# Altium schematic sheet ESP32_S3.SchDoc: =title
size A3; PageSetup: Record=PageOptions|CenterHorizontal=True|CenterVertical=True|PrintScale=1.00|XCorrection=1.00|YCorrection=1.00|PrintKind=0|BorderSize=5000000|LeftOffset=0|BottomOffset=0|Orientation=2|PaperLength=1000|PaperWidth=1000|Scale=100|PaperSource=15|PrintQuality=600|MediaType=1|DitherType=10|PaperKind=Letter|PrintScaleMode=1; DocumentNumber: 4; SheetNumber: 4; SheetTotal: 9
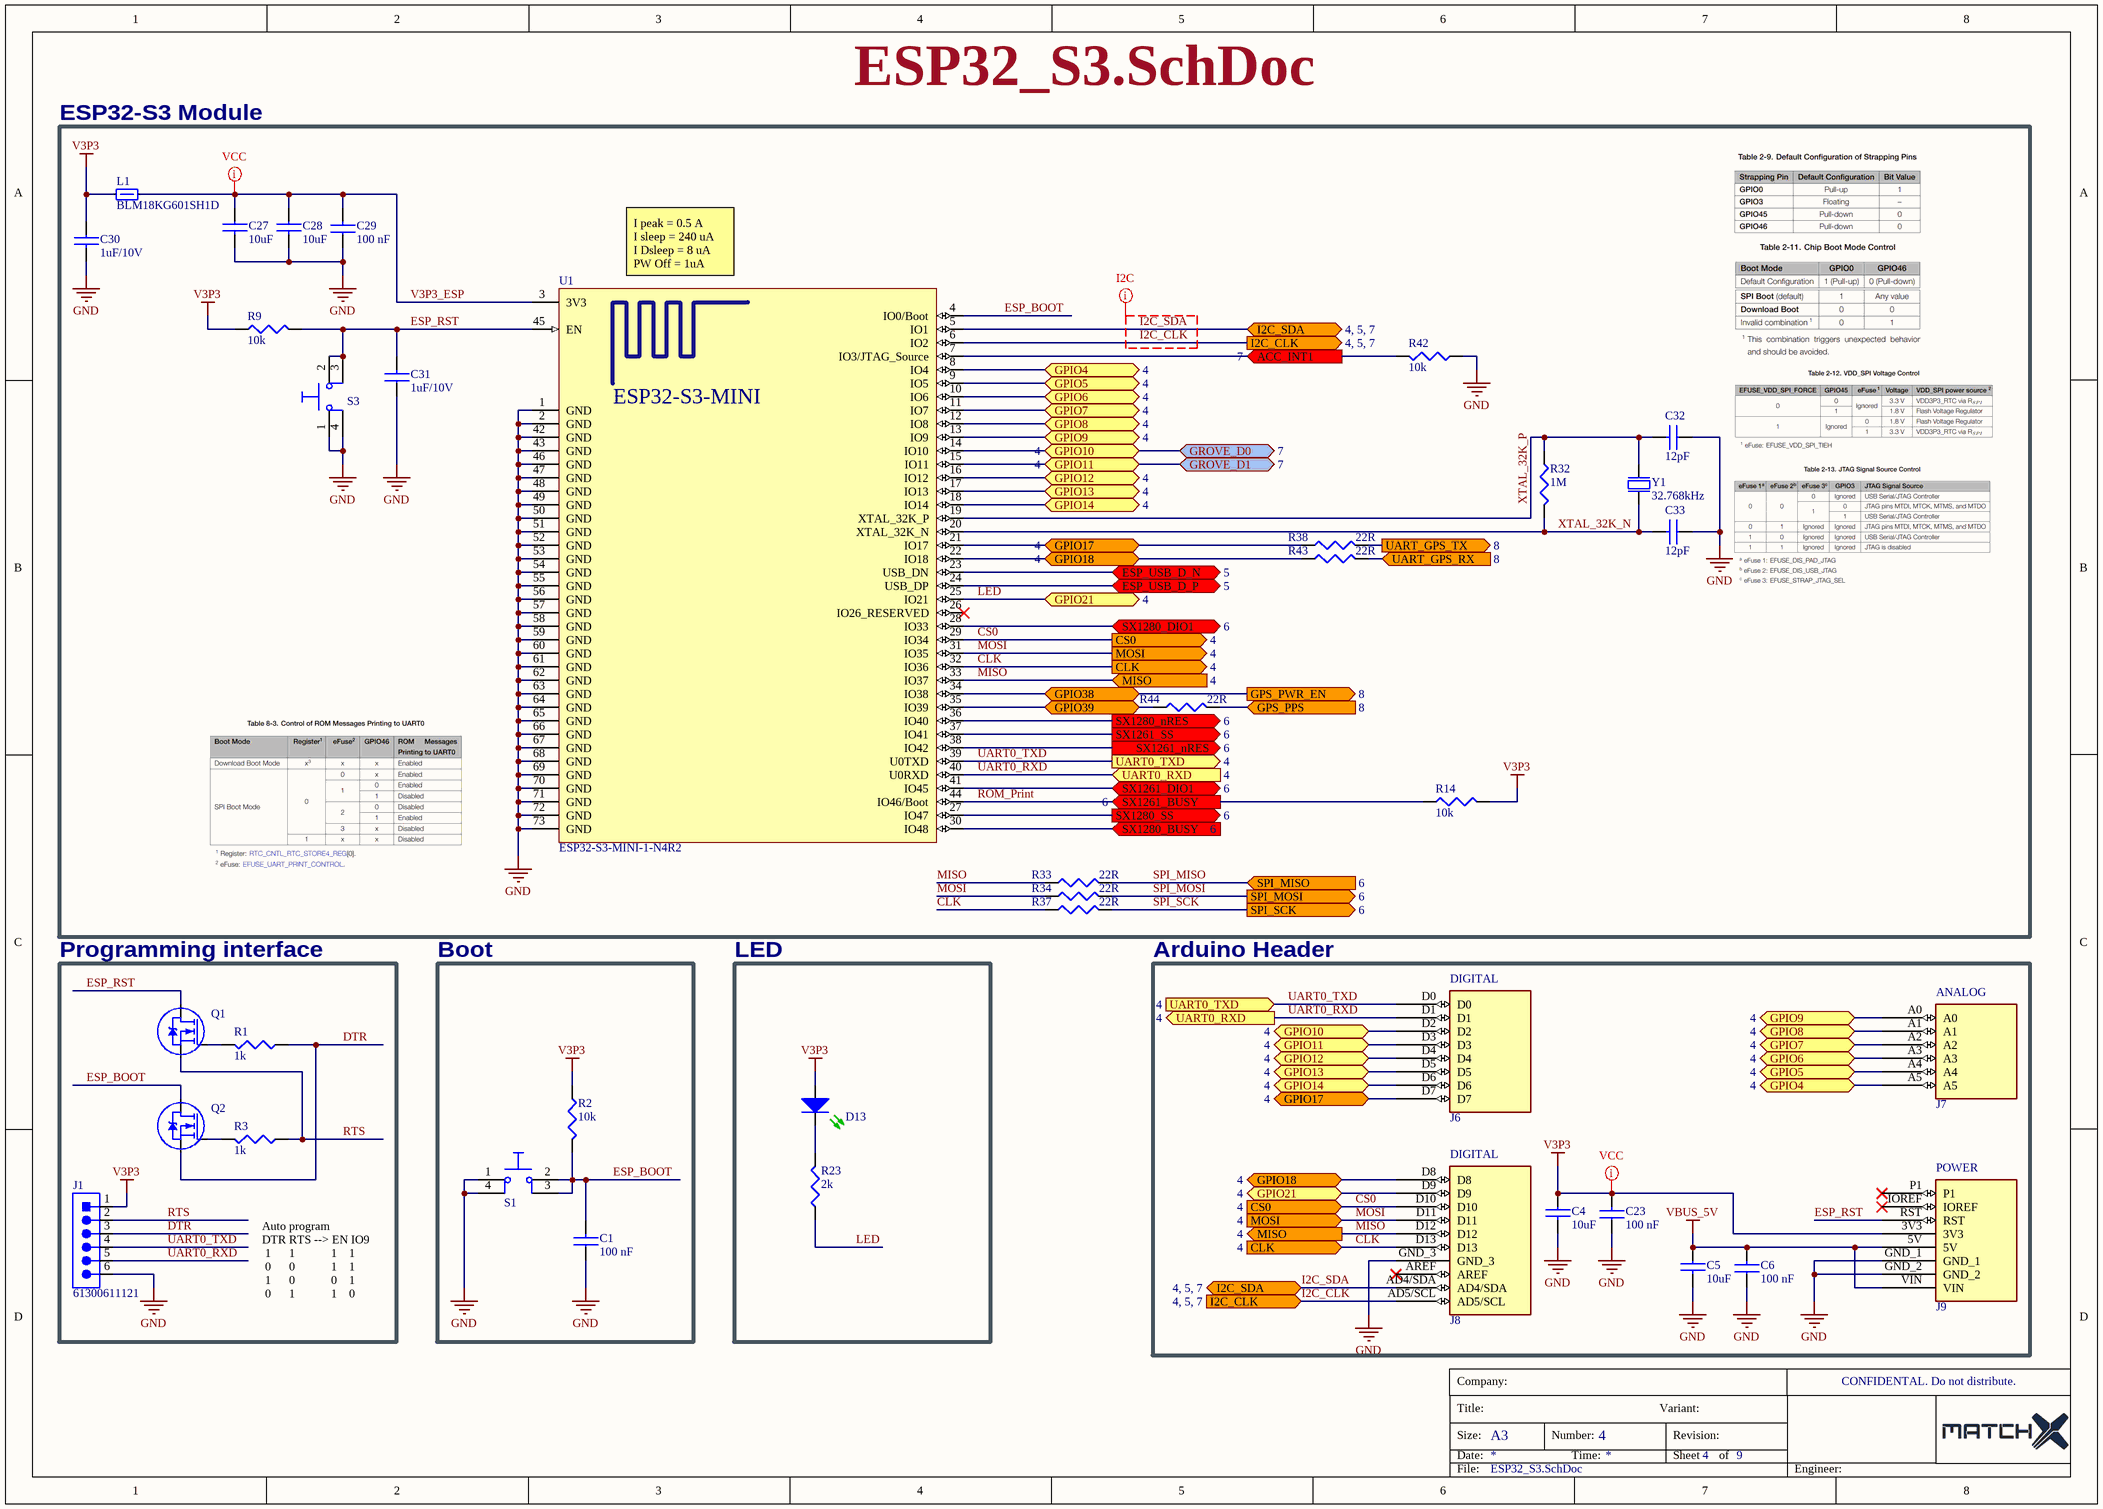
[diagram p0: ESP32_S3.SchDoc]

## Parts
C1  100 nF  [C0402]
C4  10uF  [C0805]
C5  10uF  [C0805]
C6  100 nF  [C0402]
C23  100 nF  [C0402]
C27  10uF  [C0805]
C28  10uF  [C0805]
C29  100 nF  [C0402]
C30  1uF/10V  [C0402]
C31  1uF/10V  [C0402]
C32  12pF  [C0402]
C33  12pF  [C0402]
D13  LTST-S270KGKT  [LED0603_RA]  (value not drawn)
J1  61300611121  [WURTH_61300611121]
J6  Arduino_Conn  [Arduino-C]  (value not drawn)
J7  Arduino_Conn  [Arduino-B]  (value not drawn)
J8  Arduino_Conn  [Arduino-D]  (value not drawn)
J9  Arduino_Conn  [Arduino-A]  (value not drawn)
L1  BLM18KG601SH1D  [L0603]
Q1  DMN3023L-7  [SOT-23]  (value not drawn)
Q2  DMN3023L-7  [SOT-23]  (value not drawn)
R1  1k  [R0603]
R2  10k  [R0402]
R3  1k  [R0603]
R9  10k  [R0402]
R14  10k  [R0402]
R23  2k  [R0603]
R32  1M  [R0402]
R33  22R  [R0402]
R34  22R  [R0402]
R37  22R  [R0402]
R38  22R  [R0402]
R42  10k  [R0402]
R43  22R  [R0402]
R44  22R  [R0402]
S1  TS-1108A  [TS-1108A]  (value not drawn)
S3  TS-1108A  [TS-1108A]  (value not drawn)
U1  ESP32-S3-MINI-1-N4R2  [ESP32-S3-MINI-1-N4R2]
Y1  32.768kHz  [XTAL_3215]

## Blocks framed on the sheet
ESP32-S3 Module: C27-C33 L1 R9 R14 R32-R34 R37 R38 R42-R44 S3 U1 Y1
Programming interface: J1 Q1 Q2 R1 R3
Boot: C1 R2 S1
LED: D13 R23
Arduino Header: C4-C6 C23 J6-J9

## Ports
ACC_INT1 (in, see 7), CLK (in, see 4), CLK (out, see 4), CS0 (in, see 4), CS0 (out, see 4), ESP_USB_D_N (bidir, see 5), ESP_USB_D_P (bidir, see 5), GPIO4 (bidir, see 4), GPIO5 (bidir, see 4), GPIO6 (bidir, see 4), GPIO7 (bidir, see 4), GPIO8 (bidir, see 4), GPIO9 (bidir, see 4), GPIO10 (bidir, see 4), GPIO11 (bidir, see 4), GPIO12 (bidir, see 4), GPIO13 (bidir, see 4), GPIO14 (bidir, see 4), GPIO17 (bidir, see 4), GPIO18 (bidir, see 4), GPIO21 (bidir, see 4), GPIO38 (bidir), GPIO39 (bidir), GPS_PPS (in, see 8), GPS_PWR_EN (out, see 8), GROVE_D0 (bidir, see 7), GROVE_D1 (bidir, see 7), I2C_CLK (in, see 4, 5, 7), I2C_CLK (out, see 4, 5, 7), I2C_SDA (bidir, see 4, 5, 7), MISO (in, see 4), MISO (out, see 4), MOSI (in, see 4), MOSI (out, see 4), SPI_MISO (in, see 6), SPI_MOSI (out, see 6), SPI_SCK (out, see 6), SX1261_BUSY (in, see 6), SX1261_DIO1 (bidir, see 6), SX1261_nRES (out, see 6), SX1261_SS (out, see 6), SX1280_BUSY (in, see 6), SX1280_DIO1 (bidir, see 6), SX1280_nRES (out, see 6), SX1280_SS (out, see 6), UART0_RXD (in, see 4), UART0_RXD (out, see 4), UART0_TXD (in, see 4), UART0_TXD (out, see 4), UART_GPS_RX (in, see 8), UART_GPS_TX (out, see 8)

## Nets
GND: C1.1 C4.2 C5.2 C6.1 C23.1 C27.2 C28.2 C29.1 C30.2 C31.1 C32.1 C33.1 J1.6 J8.GND_3 J9.GND_1 J9.GND_2 R42.1 S1.1 S1.4 S3.1 S3.4 U1.1(GND) U1.2(GND) U1.42(GND) U1.43(GND) U1.46(GND) U1.47(GND) U1.48(GND) U1.49(GND) U1.50(GND) U1.51(GND) U1.52(GND) U1.53(GND) U1.54(GND) U1.55(GND) U1.56(GND) U1.57(GND) U1.58(GND) U1.59(GND) U1.60(GND) U1.61(GND) U1.62(GND) U1.63(GND) U1.64(GND) U1.65(GND) U1.66(GND) U1.67(GND) U1.68(GND) U1.69(GND) U1.70(GND) U1.71(GND) U1.72(GND) U1.73(GND)
V3P3: C4.1 C23.2 C30.1 D13.A J1.1 J9.3V3 L1.1 R2.1 R9.1 R14.2
VBUS_5V: C5.1 C6.2 J9.5V J9.VIN
ACC_INT1: R42.2 U1.7(IO3/JTAG_Source) ; port ACC_INT1
CLK: J8.D13 R37.1 U1.32(IO36) ; port CLK
CS0: J8.D10 U1.29(IO34) ; port CS0
DTR: J1.3 Q2.2(S) R1.2
ESP_BOOT: C1.2 Q2.3(D) R2.2 S1.2 S1.3 U1.4(IO0/Boot)
ESP_RST: C31.2 J9.RST Q1.3(D) R9.2 S3.2 S3.3 U1.45(EN)
ESP_USB_D_N: U1.23(USB_DN) ; port ESP_USB_D_N
ESP_USB_D_P: U1.24(USB_DP) ; port ESP_USB_D_P
GPIO4: J7.A5 U1.8(IO4) ; port GPIO4
GPIO5: J7.A4 U1.9(IO5) ; port GPIO5
GPIO6: J7.A3 U1.10(IO6) ; port GPIO6
GPIO7: J7.A2 U1.11(IO7) ; port GPIO7
GPIO8: J7.A1 U1.12(IO8) ; port GPIO8
GPIO9: J7.A0 U1.13(IO9) ; port GPIO9
GPIO10: J6.D2 U1.14(IO10) ; port GROVE_D0, port GPIO10
GPIO11: J6.D3 U1.15(IO11) ; port GROVE_D1, port GPIO11
GPIO12: J6.D4 U1.16(IO12) ; port GPIO12
GPIO13: J6.D5 U1.17(IO13) ; port GPIO13
GPIO14: J6.D6 U1.18(IO14) ; port GPIO14
GPIO17: J6.D7 R38.1 U1.21(IO17) ; port GPIO17
GPIO18: J8.D8 R43.1 U1.22(IO18) ; port GPIO18
GPIO38: U1.34(IO38) ; port GPIO38, port GPS_PWR_EN
GPIO39: R44.1 U1.35(IO39) ; port GPIO39
GPS_PPS: R44.2 ; port GPS_PPS
I2C_CLK: J8.AD5/SCL U1.6(IO2) ; port I2C_CLK
I2C_SDA: J8.AD4/SDA U1.5(IO1) ; port I2C_SDA
LED: J8.D9 R23.2 U1.25(IO21) ; port GPIO21
MISO: J8.D12 R33.1 U1.33(IO37) ; port MISO
MOSI: J8.D11 R34.1 U1.31(IO35) ; port MOSI
ROM_Print: R14.1 U1.44(IO46/Boot) ; port SX1261_BUSY
RTS: J1.2 Q1.2(S) R3.2
SPI_MISO: R33.2 ; port SPI_MISO
SPI_MOSI: R34.2 ; port SPI_MOSI
SPI_SCK: R37.2 ; port SPI_SCK
SX1261_DIO1: U1.41(IO45) ; port SX1261_DIO1
SX1261_nRES: U1.38(IO42) ; port SX1261_nRES
SX1261_SS: U1.37(IO41) ; port SX1261_SS
SX1280_BUSY: U1.30(IO48) ; port SX1280_BUSY
SX1280_DIO1: U1.28(IO33) ; port SX1280_DIO1
SX1280_nRES: U1.36(IO40) ; port SX1280_nRES
SX1280_SS: U1.27(IO47) ; port SX1280_SS
UART0_RXD: J1.5 J6.D1 U1.40(U0RXD) ; port UART0_RXD
UART0_TXD: J1.4 J6.D0 U1.39(U0TXD) ; port UART0_TXD
UART_GPS_RX: R43.2 ; port UART_GPS_RX
UART_GPS_TX: R38.2 ; port UART_GPS_TX
V3P3_ESP: C27.1 C28.1 C29.2 L1.2 U1.3(3V3)
XTAL_32K_N: C33.2 R32.1 U1.20(XTAL_32K_N) Y1.1(inp)
XTAL_32K_P: C32.2 R32.2 U1.19(XTAL_32K_P) Y1.2(out)
NetD13_K: D13.K R23.1
NetQ1_1: Q1.1(G) R1.1
NetQ2_1: Q2.1(G) R3.1

Not connected (* = marked no-connect by the designer): J8 AREF*; J9 IOREF* P1*; U1 26(IO26_RESERVED)*

## Layout directives
net class VCC: V3P3, V3P3_ESP
net class I2C: I2C_CLK, I2C_SDA

## Notes on the sheet
- (near U1) I peak = 0.5 A
  I sleep = 240 uA
  I Dsleep = 8 uA
  PW Off = 1uA
- Auto program
  DTR RTS --> EN IO9
  1      1            1    1
  0      0            1    1
  1      0            0    1
  0      1            1    0
- Company:
- CONFIDENTAL. Do not distribute.
- Title:
- Size:
- Date:
- A3
- Number:
- Time:
- Variant:
- Revision:
- Sheet
- of
- File:
- Engineer:
- (in symbol Arduino_Conn_A) POWER
- (in symbol Arduino_Conn_B) ANALOG
- (in symbol Arduino_Conn_C) DIGITAL
- (in symbol Arduino_Conn_D) DIGITAL
- (in symbol ESP32-S3-MINI-1-N4R2) ESP32-S3-MINI

## Library data of the parts
C1 C6 C23 C29 = C0402-100nF_50V: CAP, CERM, 100 nF, 50V, +/- 10%, X7R, 0402; Manufacturer Part Number: GRM155R71H104KE14J; CompType: Capacitor; Category: Capacitors; Operating Temperature: -55°C ~ 125°C; Package / Case: 0402; RoHS: RoHS Compliant; Temperature Coefficient: X7R; Tolerance: 10%; Voltage - Rated: 50 V; MountType: SMT; Technology: Ceramic; Value: 100 nF
C4 C5 C27 C28 = C0805-10uF_16V: CAP, CERM, 10uF, 16V, +/- 20%, X5R, 0805; Manufacturer Part Number: GRM21BR61C106KE15L; CompType: Capacitor; Category: Capacitors; Operating Temperature: -55°C ~ 85°C; Package / Case: 0805 (2012 Metric); RoHS: RoHS Compliant; Temperature Coefficient: X5R; Tolerance: 20%; Voltage - Rated: 16 V; MountType: SMT; Technology: Ceramic; Value: 10uF
C30 C31 = C0402-1uF_10V: CAP, CERM, 1 uF, 10V, +/- 10%, X5R, 0402; Manufacturer Part Number: C0402C105M8PACTU; CompType: Capacitor; Category: Capacitors; Operating Temperature: -55°C ~ 85°C; Package / Case: 0402; RoHS: RoHS Compliant; Temperature Coefficient: X5R; Tolerance: 10%; Voltage - Rated: 10V; MountType: SMT; Technology: Ceramic; Value: 1uF/10V
C32 C33 = C0402-12pF: CAP, CERM, 12pF, 16V, +/- 5%, C0G/NP0, 0402; Manufacturer Part Number: GRM0225C1C120GA03L; CompType: Capacitor; Category: Capacitors; Operating Temperature: -55°C ~ 125°C; Package / Case: 0402; RoHS: RoHS Compliant; Temperature Coefficient: C0G/NP0; Tolerance: 5%; Voltage - Rated: 16 V; MountType: SMT; Technology: Ceramic; Value: 12pF
D13 = LED_GREEN_0603_RA: LED GREEN CLEAR 0603 R/A SMD / LED Uni-Color Green 574nm 2-Pin Chip LED T/R; Manufacturer: Vishay Lite-On; Viewing Angle: 130°; Lens Color: Colorless; Forward Current: 30mA; Forward Voltage: 2V; Power Rating: 75mW; Luminous Intensity: 71mcd; Lens Style: Flat,Diffused,Colorless,Rectangular,Clear; Dominant Wavelength: 571nm; Test Current: 20mA; Number of Elements: 1; Reverse Voltage: 5V; Lens Size: 0.6mm; Supplier 1: Digikey; Manufacturer Part Number: LTST-S270KGKT; Stock 1: 117112; Pricing 1: 1=0,24, 10=0,133, 100=0,0617, 500=0,05696, 1000=0,04462, 2000=0,04367 (USD); ComponentLink1URL: https://datasheet.ciiva.com/2110/ltst-s270kgkt-2110006.pdf?src-supplier=Digikey; ComponentLink1Description: https://datasheet.ciiva.com/2110/ltst-s270kgkt-2110006.pdf?src-supplier=Digikey; Category: LEDs; Packaging: Tape and Reel; Color: Green; ComponentLink2URL: https://datasheet.ciiva.com/11774/0900766b80dc0b88-11774745.pdf?src-supplier=Rs; ComponentLink2Description: https://datasheet.ciiva.com/11774/0900766b80dc0b88-11774745.pdf?src-supplier=Rs; Supplier Part Number 1: 160-1478-1-ND; Series: -; Height: 0.6mm; ComponentLink3URL: https://datasheet.ciiva.com/12400/ltst-s270kgkt-201847-12400865.pdf?src-supplier=Mouser; ComponentLink3Description: https://datasheet.ciiva.com/12400/ltst-s270kgkt-201847-12400865.pdf?src-supplier=Mouser; ComponentLink4URL: https://datasheet.ciiva.com/4266/dwonloadfilehandler-ashxtxtspecnods222000226-4266440.pdf?src-supplier=Arrow+Electronics; ComponentLink4Description: https://datasheet.ciiva.com/4266/dwonloadfilehandler-ashxtxtspecnods222000226-4266440.pdf?src-supplier=Arrow+Electronics; RoHS: Yes; Mount: Surface Mount; Case/Package: 0603; Number of Pins: 2; Case Code (Metric): 1608; Case Code (Imperial): 0603; Min Operating Temperature: -55°C; Max Operating Temperature: 85°C; Illumination Color: Green; Package Quantity: 4000; Lens Transparency: Clear; Power Dissipation: 75mW; Number of LEDs: 1; Wavelength: 574nm; Length: 1.6mm; Width: 1.15mm; Depth: 0.6mm; Radiation Hardening: No; RoHS Compliant: Yes; Lead Free: 5697LeadFree; ComponentLink5URL: https://datasheet.ciiva.com/2110/s-110-ltst-s270kgkt-2110007.pdf?src-supplier=Digikey; ComponentLink5Description: https://datasheet.ciiva.com/2110/s-110-ltst-s270kgkt-2110007.pdf?src-supplier=Digikey; ComponentLink6URL: https://datasheet.ciiva.com/2110/s-110-ltst-s270kgkt-2110008.pdf?src-supplier=Digikey; ComponentLink6Description: https://datasheet.ciiva.com/2110/s-110-ltst-s270kgkt-2110008.pdf?src-supplier=Digikey; ComponentLink7URL: https://datasheet.ciiva.com/16448/ltst-s270kgkt-16448566.pdf?src-supplier=Future+Electronics; ComponentLink7Description: https://datasheet.ciiva.com/16448/ltst-s270kgkt-16448566.pdf?src-supplier=Future+Electronics
J1 = CON_61300611121: Header, 2.54 mm, 6x1, Gold, TH; Manufacturer: Wurth Electronics; Connector Type: Header, Unshrouded; Number of Positions: 6; Number of Positions Loaded: All; Pitch: 0.100" (2.54mm); Supplier 1: Digikey; Supplier Part Number 1: 732-5318-ND; Manufacturer Part Number: 61300611121; Stock 1: 0; Pricing 1: 1=0.25, 10=0.209, 25=0.174, 50=0.145, 100=0.132, 1000=0.12 (USD); Category: Connectors, Interconnects; Family: Rectangular Connectors - Headers, Male Pins; Series: WR-PHD; Packaging: Bulk; Contact Type: Male Pin; Number of Rows: 1; Row Spacing: -; Contact Mating Length: 0.236" (6.00mm); Mounting Type: Through Hole; Termination: Solder; Fastening Type: -; Features: -; Contact Finish: Gold; Contact Finish Thickness: -; Color: Black; ComponentLink1URL: http://www.farnell.com/cad/1737268.pdf; ComponentLink1Description: http://www.farnell.com/cad/1737268.pdf
J6 = Arduino_Conn_C: Arduino Template; pin to pad: A4/SDA>A4(SDA; Manufacturer Part Number: M20-7820842; Manufacturer: Harwin; MP: Arduino Uno Rev3; Value: *; SnapEDA_Link: https://www.snapeda.com/parts/Arduino%20Uno%20Rev3/Arduino/view-part/?ref=snap; MF: Arduino; Availability: Not in stock; Price: None; Package: Non-Standard Arduino; Check_prices: https://www.snapeda.com/parts/Arduino%20Uno%20Rev3/Arduino/view-part/?ref=eda
J7 = Arduino_Conn_B: Arduino Template; pin to pad: A4/SDA>A4(SDA; Manufacturer Part Number: M20-7820646; Manufacturer: Harwin; MP: Arduino Uno Rev3; Value: *; SnapEDA_Link: https://www.snapeda.com/parts/Arduino%20Uno%20Rev3/Arduino/view-part/?ref=snap; MF: Arduino; Availability: Not in stock; Price: None; Package: Non-Standard Arduino; Check_prices: https://www.snapeda.com/parts/Arduino%20Uno%20Rev3/Arduino/view-part/?ref=eda
J8 = Arduino_Conn_D: Arduino Template; pin to pad: A4/SDA>A4(SDA; Manufacturer Part Number: M20-7821042; Manufacturer: Harwin; MP: Arduino Uno Rev3; Value: *; SnapEDA_Link: https://www.snapeda.com/parts/Arduino%20Uno%20Rev3/Arduino/view-part/?ref=snap; MF: Arduino; Availability: Not in stock; Price: None; Package: Non-Standard Arduino; Check_prices: https://www.snapeda.com/parts/Arduino%20Uno%20Rev3/Arduino/view-part/?ref=eda
J9 = Arduino_Conn_A: Arduino Template; pin to pad: A4/SDA>A4(SDA; Manufacturer Part Number: M20-7820842; Manufacturer: Harwin; MP: Arduino Uno Rev3; Value: *; SnapEDA_Link: https://www.snapeda.com/parts/Arduino%20Uno%20Rev3/Arduino/view-part/?ref=snap; MF: Arduino; Availability: Not in stock; Price: None; Package: Non-Standard Arduino; Check_prices: https://www.snapeda.com/parts/Arduino%20Uno%20Rev3/Arduino/view-part/?ref=eda
L1 = BLM18KG601SH1D: Ferrite Beads 0603 600ohms 1.3A DCR=.15ohms; Manufacturer: Murata Electronics North America; Filter Type: Power Line; Number of Lines: 1; Impedance @ Frequency: 600 Ohm @ 100MHz; DC Resistance (DCR) (Max): 150 mOhm; Supplier 1: Digi-Key; Manufacturer Part Number: BLM18KG601SH1D; RoHS: RoHS Compliant; Category: Filters; Stock 1: 5830; Pricing 1: 1=0.11, 10=0.088, 50=0.058, 100=0.0502, 250=0.0396, 500=0.03344, 1000=0.02816 (USD); Packaging: Cut Tape (CT); Current Rating (Max): 1.3A; Ratings: AEC-Q200; Operating Temperature: -55°C ~ 125°C; Package / Case: 0603 (1608 Metric); Mounting Type: Surface Mount; Height (Max): 0.037" (0.95mm); Size / Dimension: 0.063" L x 0.032" W (1.60mm x 0.80mm); ComponentLink1URL: http://www.murata.com/en-global/products/productdata/8796737273886/QNFA9101.pdf; ComponentLink1Description: http://www.murata.com/en-global/products/productdata/8796737273886/QNFA9101.pdf; Supplier Part Number 1: 490-13259-1-ND
Q1 Q2 = NMOSFET_DMN3023L-7: MOSFETN-CH 30V 6.2A SOT23-3; Manufacturer: Diodes; .Checked PCB: OK M; Rds On Max: 25mR; Input Capacitance: 873pF; Max Power Dissipation: 900mW; Supplier 1: Digi-Key; Supplier Part Number 1: DMN3023L-7DICT-ND; Manufacturer Part Number: DMN3023L-7; RoHS: Yes; Category: MOSFETs; Stock 1: 420813; Pricing 1: 1=0,41000, 10=0,33100, 100=0,22560, 500=0,16922, 1000=0,12692 (USD); RoHS Compliant: Yes; ComponentLink1URL: http://www.farnell.com/datasheets/2814401.pdf?src-supplier=Farnell; ComponentLink1Description: http://www.farnell.com/datasheets/2814401.pdf?src-supplier=Farnell; ComponentLink2URL: http://www.mouser.com/ds/2/115/DMN3023L-959533.pdf?src-supplier=Mouser; ComponentLink2Description: http://www.mouser.com/ds/2/115/DMN3023L-959533.pdf?src-supplier=Mouser; ComponentLink3URL: http://www.farnell.com/datasheets/2814401.pdf?src-supplier=Newark; ComponentLink3Description: http://www.farnell.com/datasheets/2814401.pdf?src-supplier=Newark; ComponentLink4URL: http://www.farnell.com/datasheets/2814401.pdf?src-supplier=Element14; ComponentLink4Description: http://www.farnell.com/datasheets/2814401.pdf?src-supplier=Element14; .Checked SCH: OK M; Mount: Surface Mount; Case/Package: TO-236-3; Min Operating Temperature: -55°C; Max Operating Temperature: 150°C; Packaging: Tape and Reel; Drain to Source Voltage (Vdss): 30V; Continuous Drain Current (ID): 6.2A; ComponentLink5URL: https://www.diodes.com/assets/Datasheets/DMN3023L.pdf?src-supplier=Digi-Key; ComponentLink5Description: https://www.diodes.com/assets/Datasheets/DMN3023L.pdf?src-supplier=Digi-Key
R1 R3 = R0603-1k: RES, 1k, 1%, 0.063 W, 0603; Manufacturer Part Number: AC0603FR-101KL; Power (Watts): 0.063W, 1/16W; .Checked PCB: OK RF; .Checked SCH: RF; Category: Resistors; Package / Case: 0603 [1608 Metric]; Tolerance: ±1%; Value: 1k; RoHS: RoHS Compliant; Composition: Thick Film; Features: -; Size / Dimension: 0.063" L x 0.031" W (1.60mm x 0.80mm); Height: 0.016" (0.40mm); Number of Terminations: 2
R2 R9 R14 R42 = R0402-10k: RES, 10k, 1%, 1/16 W, 0402; Manufacturer Part Number: RE0402FRE0710KL; Power (Watts): 0.063W, 1/16W; .Checked PCB: OK RF; .Checked SCH: RF; Category: Resistors; Package / Case: 0402; Tolerance: ±1%; Value: 10k; RoHS: RoHS Compliant; Composition: Thick Film; Features: -; Size / Dimension: 0.039" L x 0.020" W (1.00mm x 0.50mm); Height: 0.016" (0.40mm); Number of Terminations: 2
R23 = R0603-2k: RES, 2k, 1%, 0.063 W, 0603; Manufacturer Part Number: RE0603FRE072KL; Power (Watts): 0.063W, 1/16W; .Checked PCB: OK RF; .Checked SCH: RF; Category: Resistors; Package / Case: 0603 [1608 Metric]; Tolerance: ±1%; Value: 2k; RoHS: RoHS Compliant; Composition: Thick Film; Features: -; Size / Dimension: 0.063" L x 0.031" W (1.60mm x 0.80mm); Height: 0.016" (0.40mm); Number of Terminations: 2
R32 = R0402-1M: RES, 1M, 1%, 1/16 W, 0402; Manufacturer Part Number: RC0402FR-101ML; Power (Watts): 0.063W, 1/16W; .Checked PCB: OK RF; .Checked SCH: RF; Category: Resistors; Package / Case: 0402; Tolerance: ±1%; Value: 1M; RoHS: RoHS Compliant; Composition: Thick Film; Features: -; Size / Dimension: 0.039" L x 0.020" W (1.00mm x 0.50mm); Height: 0.016" (0.40mm); Number of Terminations: 2
R33 R34 R37 R38 R43 R44 = R0402-22R: RES, 22R, 1%, 1/16 W, 0402; Manufacturer Part Number: RC0402FR-0722RP; Power (Watts): 0.063W, 1/16W; .Checked PCB: OK RF; .Checked SCH: RF; Category: Resistors; Package / Case: 0402; Tolerance: ±1%; Value: 22R; RoHS: RoHS Compliant; Composition: Thick Film; Features: -; Size / Dimension: 0.039" L x 0.020" W (1.00mm x 0.50mm); Height: 0.016" (0.40mm); Number of Terminations: 2
S1 S3 = TS-1108A: Switch Tactile N.O. SPST Button 12VDC 50mA 5N SMD T/R; Manufacturer: Alps Alpine; Manufacturer Part Number: SKRPASE010; RoHS: Yes; Stock 1: 3728; Pricing 1: 1=0,78000, 10=0,69500, 50=0,62700, 100=0,59800, 1000=0,48400, 10000=0,46500 (USD)
U1 = ESP32-S3-MINI-1-N4R2: WLAN-BLE Module – 802.11 SMD Module, ESP32-S3FH4R2 with 4 MB Flash Die, 2MB PSRAM, PCB Antenna; Manufacturer: Espressif Systems; Manufacturer Part Number: ESP32-S3-MINI-1-N4R2
Y1 = XTAL_2-pin_DPAF32768004_7pF: XTAL SMD 3215, 32.768kHz, 7pF, ±20ppm; Part Number: DPAF32768004 3215 32.768k 9pF; Manufacturer: Epson Timing; Manufacturer Part Number: FC-135 32.7680KA-AC0; Alternate PartNumber: FC-135 32.768KHZ ±20PPM,9.0PF; Note: XTAL SMD 32.768kHz, 3215; Pin Count: 2; Value: 32.768kHz; Package / Case: 3215; Alternate Manufacturer: Epson Timing